# Altium project FPGABoard.PrjPcb
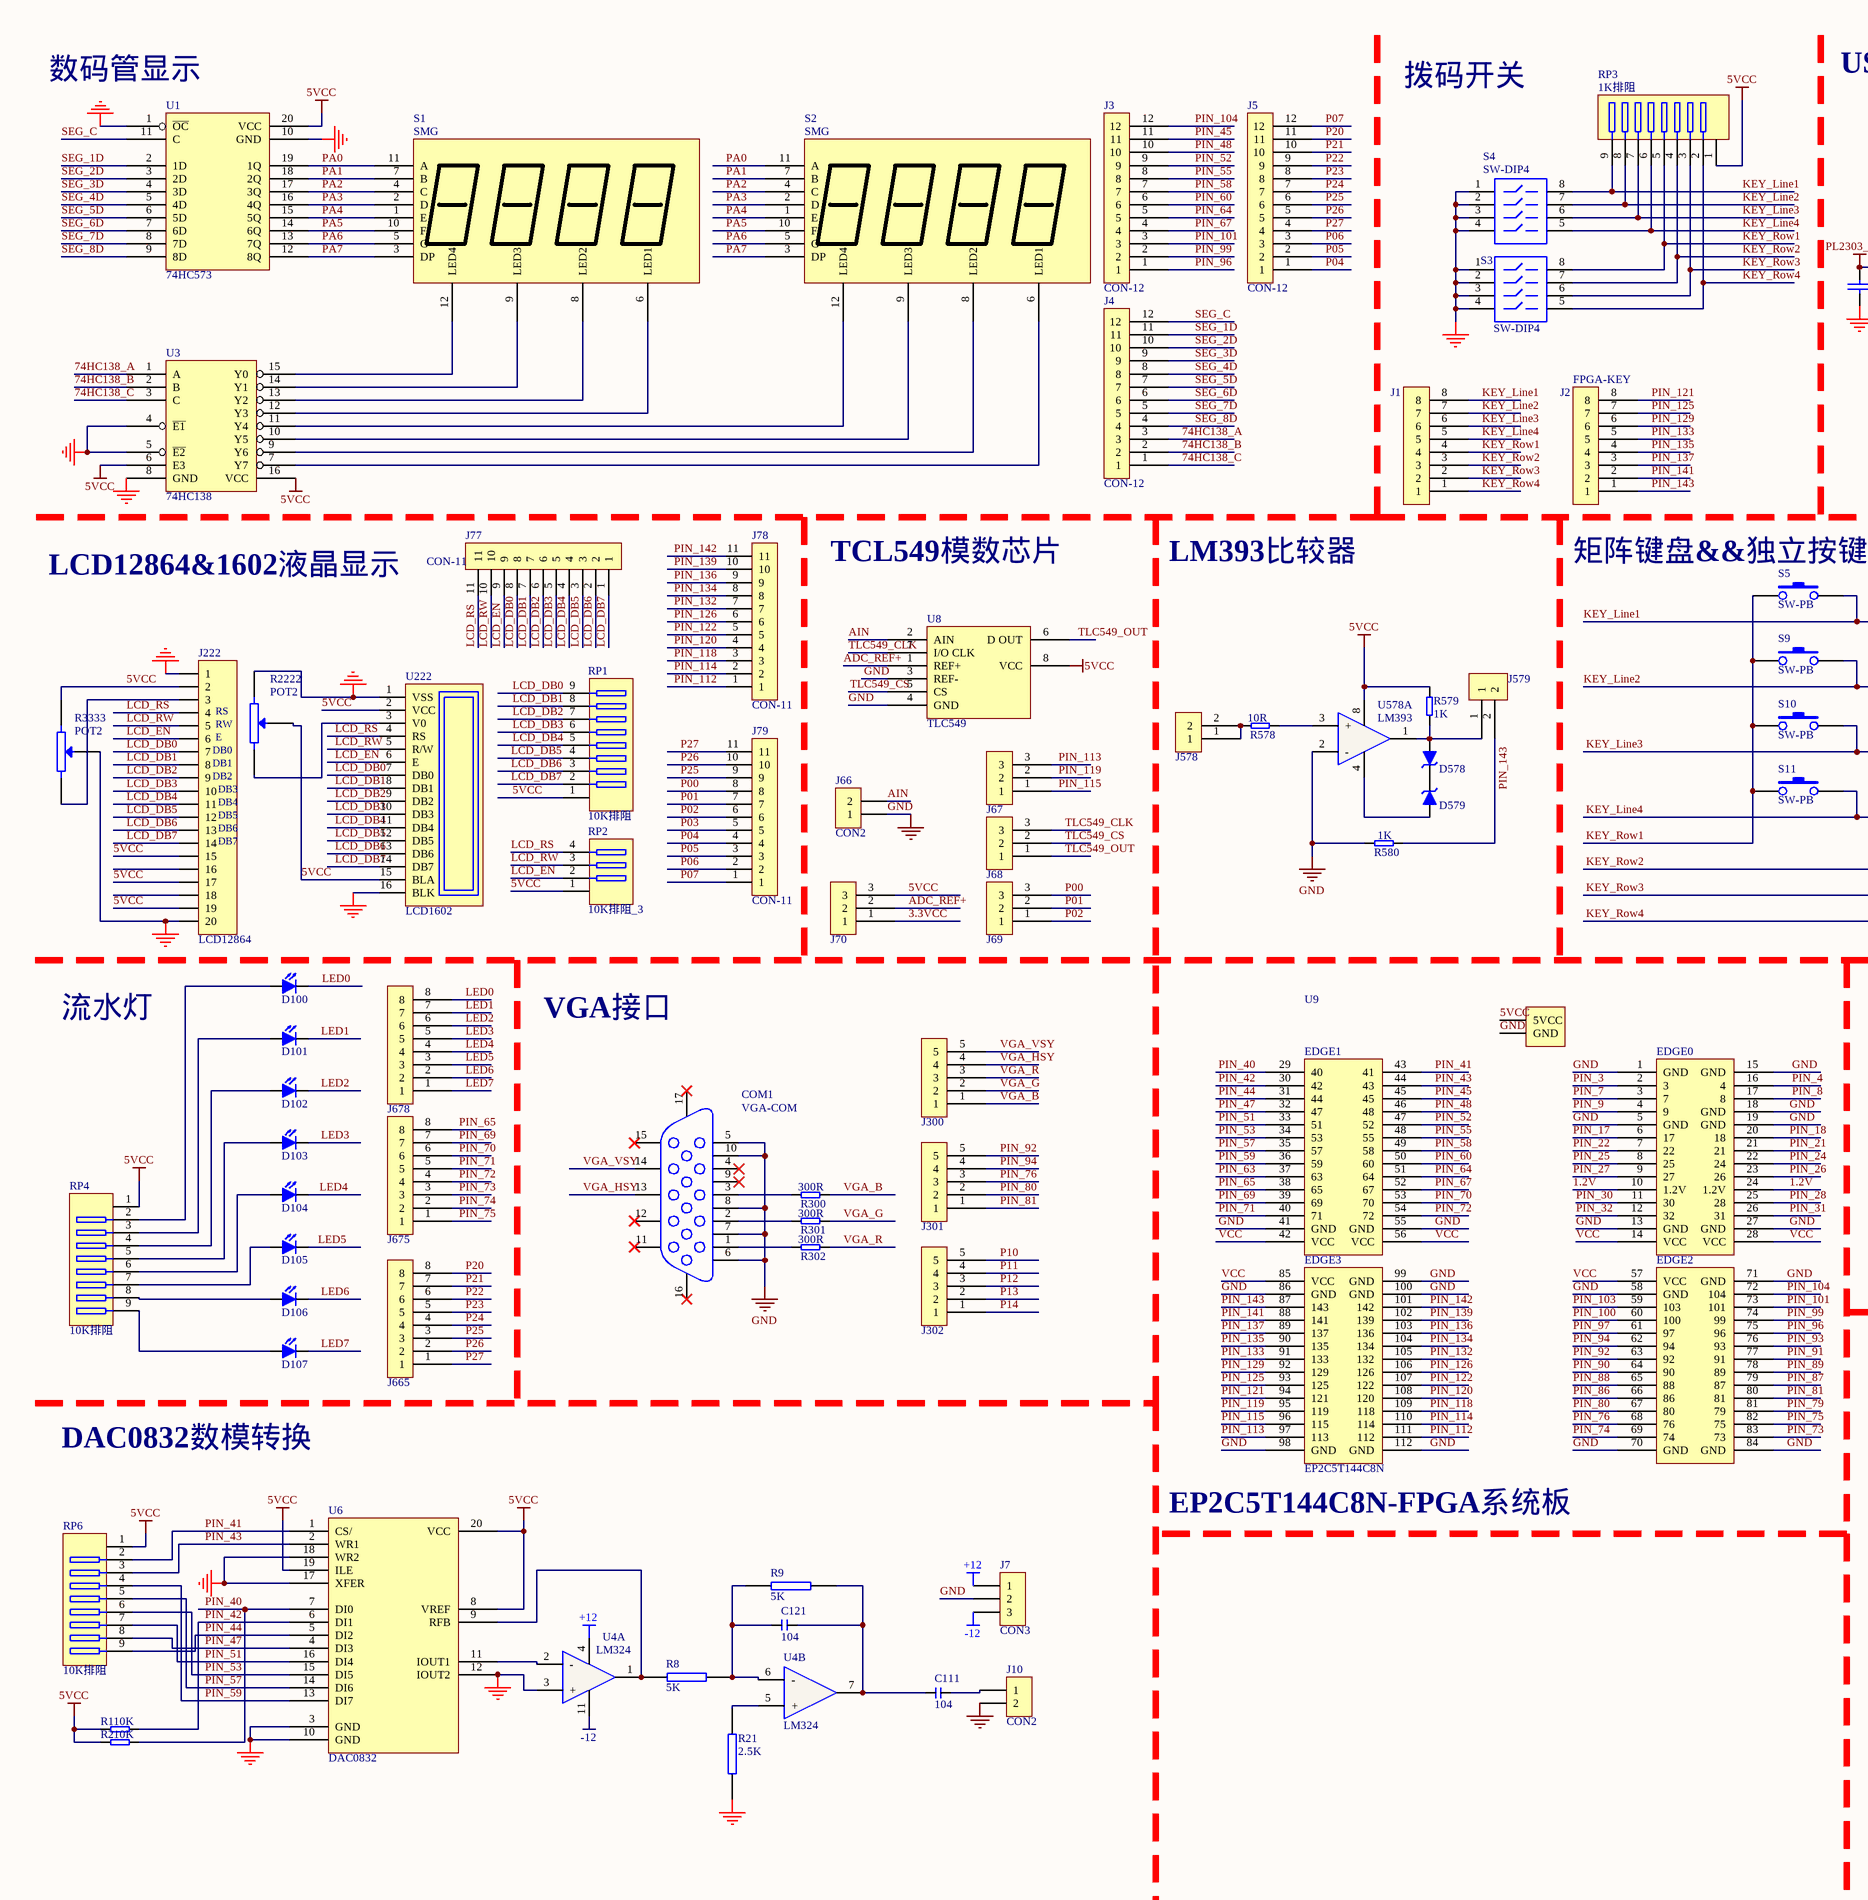
[diagram p0: FPGABoard.SchDoc, left]
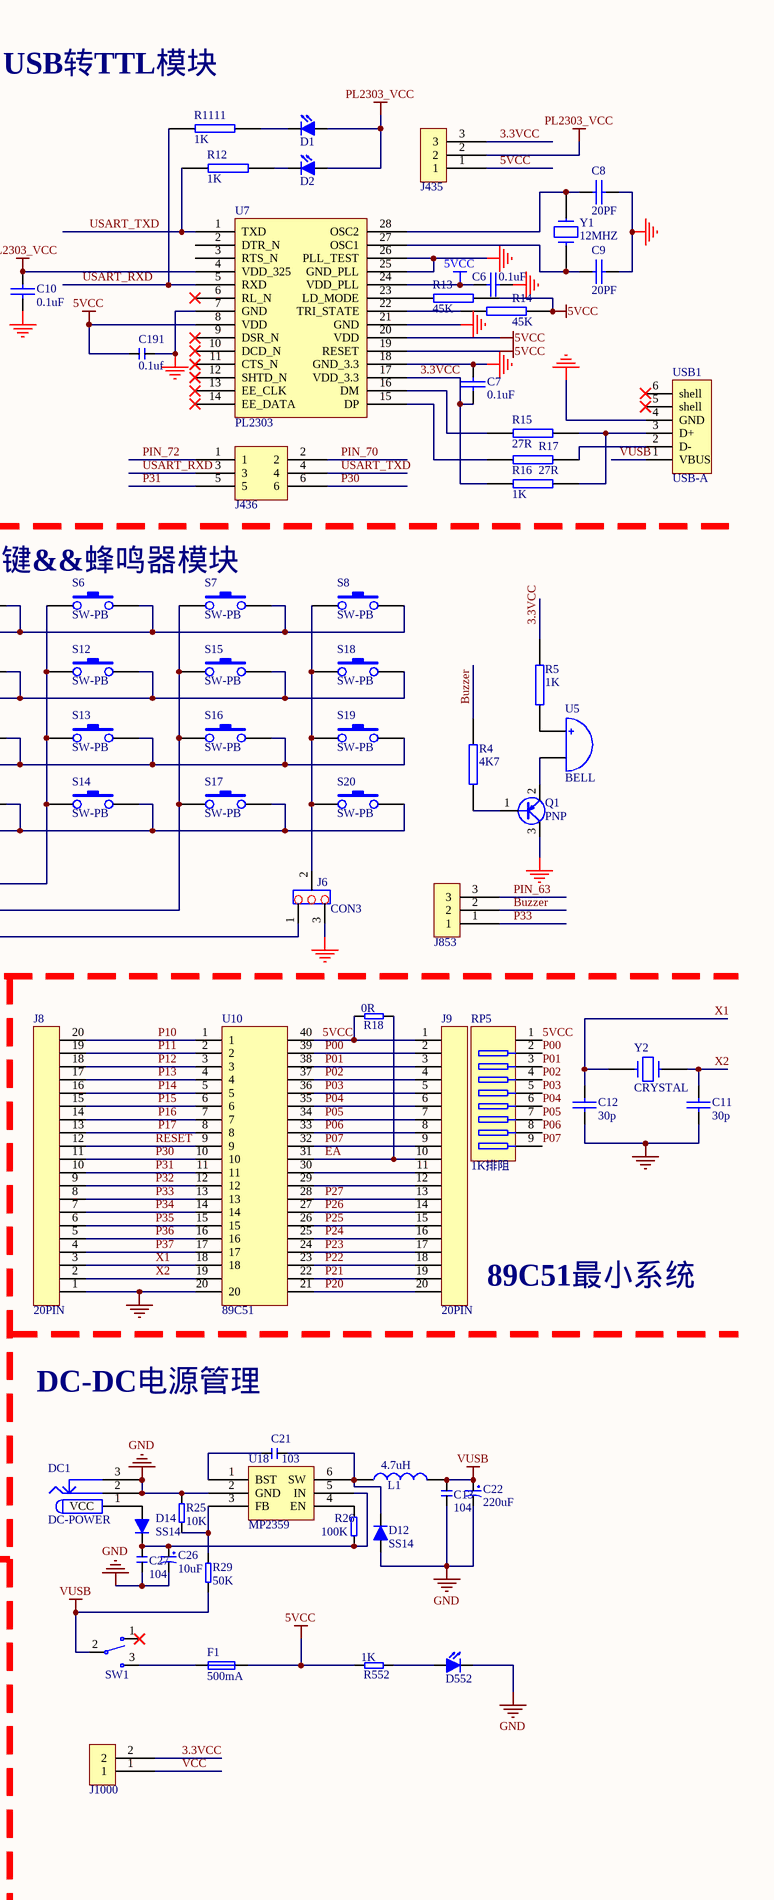
[diagram p1: FPGABoard.SchDoc, right]
1 sheet, 135 parts. Net scope: global (net labels, ports and power ports of the same name join across sheets).
Board file: FPGABoard.PcbDoc

## Sheet FPGABoard.SchDoc
size C; SheetNumber: 0; SheetTotal: 0

### Parts
C6  0.1uF  [C0805]
C7  0.1uF  [C0805]
C8  20PF  [C0805]
C9  20PF  [C0805]
C10  0.1uF  [C0805]
C11  30p  [0805]
C12  30p  [0805]
C13  104  [C0805]
C21  103  [C0805]
C22  220uF  [CA-6.3mmx6.3mm]
C26  10uF  [CA-A-3216L]
C27  104  [C0805]
C111  104  [C0805]
C121  104  [C0805]
C191  0.1uf  [C0805]
COM1  VGA-COM  [VGA-15]
D1  LED  [LED0805-RED]  (value not drawn)
D2  LED  [LED0805-RED]  (value not drawn)
D12  SS14  [DO-214]
D14  SS14  [DO-214]
D100  LED  [LED0805-RED]  (value not drawn)
D101  LED  [LED0805-RED]  (value not drawn)
D102  LED  [LED0805-RED]  (value not drawn)
D103  LED  [LED0805-RED]  (value not drawn)
D104  LED  [LED0805-RED]  (value not drawn)
D105  LED  [LED0805-RED]  (value not drawn)
D106  LED  [LED0805-RED]  (value not drawn)
D107  LED  [LED0805-RED]  (value not drawn)
D552  LED  [LED0805-GREEN]  (value not drawn)
D578  DIODE-ZENER3  [D1206]  (value not drawn)
D579  DIODE-ZENER3  [D1206]  (value not drawn)
DC1  DC-POWER  [DC-5v]
F1  500mA  [0805]
J1  CON-8  [SIP8-2.54]  (value not drawn)
J2  FPGA-KEY  [SIP8-2.54]
J3  CON-12  [SIP12-2.54]
J4  CON-12  [SIP12-2.54]
J5  CON-12  [SIP12-2.54]
J6  CON3  [SIP3-2.54]
J7  CON3  [SIP3-2.54]
J8  20PIN  [SIP20-2.54]
J9  20PIN  [SIP20-2.54]
J10  CON2  [SIP2-2.54]
J66  CON2  [SIP2-2.54]
J67  CON-3  [SIP3-2.54]  (value not drawn)
J68  CON-3  [SIP3-2.54]  (value not drawn)
J69  CON-3  [SIP3-2.54]  (value not drawn)
J70  CON-3  [SIP3-2.54]  (value not drawn)
J77  CON-11  [SIP11-2.54]
J78  CON-11  [SIP11-2.54]
J79  CON-11  [SIP11-2.54]
J222  LCD12864  [SIP20-2.54]
J300  CON-5  [SIP5-2.54]  (value not drawn)
J301  CON-5  [SIP5-2.54]  (value not drawn)
J302  CON-5  [SIP5-2.54]  (value not drawn)
J435  CON-3  [SIP3-2.54]  (value not drawn)
J436  CON-2*3  [J2X3-2.54mm]  (value not drawn)
J578  CON-2  [J1x2-2.54mm]  (value not drawn)
J579  CON-2  [J1x2-2.54mm]  (value not drawn)
J665  CON-8  [SIP8-2.54]  (value not drawn)
J675  CON-8  [SIP8-2.54]  (value not drawn)
J678  CON-8  [SIP8-2.54]  (value not drawn)
J853  CON-3  [SIP3-2.54]  (value not drawn)
J1000  CON-2  [J1x2-2.54mm]  (value not drawn)
L1  4.7uH  [L-SOP74]
Q1  PNP  [SOT-23A]
R1  10K  [R-0805]
R2  10K  [R-0805]
R4  4K7  [R0805]
R5  1K  [R0805]
R8  5K  [R0805]
R9  5K  [R0805]
R12  1K  [0805]
R13  45K  [0805]
R14  45K  [0805]
R15  27R  [0805]
R16  1K  [0805]
R17  27R  [0805]
R18  0R  [R0805]
R21  2.5K  [R0805]
R25  10K  [R-0805]
R26  100K  [R-0805]
R29  50K  [R-0805]
R300  300R  [R-0805]
R301  300R  [R-0805]
R302  300R  [R-0805]
R552  1K  [0805]
R578  10R  [R-0805]
R579  1K  [R-0805]
R580  1K  [R-0805]
R1111  1K  [0805]
R2222  POT2  [VR5]
R3333  POT2  [VR5]
RP1  10K排阻  [SIP9-2.54]
RP2  10K排阻_3  [SIP4-2.54]
RP3  1K排阻  [SIP9-2.54]
RP4  10K排阻  [SIP9-2.54]
RP5  1K排阻  [SIP9-2.54]
RP6  10K排阻  [SIP9-2.54]
S1  SMG  [LED4_0.28_DIP12]
S2  SMG  [LED4_0.28_DIP12]
S3  SW-DIP4  [DIP-KEY-4]
S4  SW-DIP4  [DIP-KEY-4]
S5  SW-PB  [KEY]
S6  SW-PB  [KEY]
S7  SW-PB  [KEY]
S8  SW-PB  [KEY]
S9  SW-PB  [KEY]
S10  SW-PB  [KEY]
S11  SW-PB  [KEY]
S12  SW-PB  [KEY]
S13  SW-PB  [KEY]
S14  SW-PB  [KEY]
S15  SW-PB  [KEY]
S16  SW-PB  [KEY]
S17  SW-PB  [KEY]
S18  SW-PB  [KEY]
S19  SW-PB  [KEY]
S20  SW-PB  [KEY]
SW1  SW-SPDP  [SW-DPDT]  (value not drawn)
U1  74HC573  [SO-20W]
U3  74HC138  [SOP-16-NB]
U4  LM324  [SOP14-225-50]  (parts A,B of 4)
U5  BELL  [BELL]
U6  DAC0832  [DIP-20N]
U7  PL2303  [SSOP-SS28_N]
U8  TLC549  [SOP-8-NB]
U9  EP2C5T144C8N  [HXB]
U10  89C51  [ZIP_40]
U18  MP2359  [SOT23-6]
U222  LCD1602  [SIP16-2.54]
U578  LM393  [SOP-8-NB]  (part A of 2)
USB1  USB-A  [USB-HD-1X1-1]
Y1  12MHZ  [XTAL]
Y2  CRYSTAL  [XTAL2]

### Nets
5VCC: C6.1 C191.1 F1.2 J9.1 J70.3 J222.2 J222.15 J222.17 J222.19 J435.1 R1.1 R2.1 R13.1 R14.1 R18.1 R552.1 R579.2 R2222.3 R3333.1 RP1.1 RP2.1 RP3.1 RP4.1 RP5.1 RP6.1 U1.20(VCC) U3.6(E3) U3.16(VCC) U6.8(VREF) U6.19(ILE) U6.20(VCC) U7.8(VDD) U7.19(RESET) U7.20(VDD) U7.24(VDD_PLL) U8.8(VCC) U9.5VCC U10.40 U222.2(VCC) U222.15(BLA) U578.8
+12: J7.1 U4.4
-12: J7.3 U4.11
GND: C6.2 C7.1 C8.2 C9.2 C10.2 C11.2 C12.2 C13.2 C22.2 C26.2 C27.2 C191.2 COM1.5 COM1.6 COM1.7 COM1.8 COM1.10 D12.1 D552.2 DC1.2(GND) DC1.3(GND) J6.3 J7.2 J8.1 J10.2 J66.1 J222.1 J222.20 Q1.3(Collector) R21.1 R25.1 R580.1 R2222.1 R3333.3 S3.1 S3.2 S3.3 S3.4 S4.1 S4.2 S4.3 S4.4 U1.1(~{OC}) U1.10(GND) U3.4(~{E1}) U3.5(~{E2}) U3.8(GND) U4.3(+) U6.3(GND) U6.10(GND) U6.12(IOUT2) U6.17(XFER) U6.18(WR2) U7.7(GND) U7.18(GND_3.3) U7.21(GND) U7.25(GND_PLL) U7.26(PLL_TEST) U8.3(REF-) U8.4(GND) U9.1(GND) U9.5(GND) U9.13(GND) U9.15(GND) U9.18(GND) U9.19(GND) U9.27(GND) U9.41(GND) U9.55(GND) U9.58(GND) U9.70(GND) U9.71(GND) U9.84(GND) U9.86(GND) U9.98(GND) U9.99(GND) U9.100(GND) U9.112(GND) U9.GND U10.20 U18.2(GND) U222.1(VSS) U222.16(BLK) U578.2(-) USB1.4(GND)
PL2303_VCC: C10.1 D1.1 D2.1 J435.2 U7.4(VDD_325)
VUSB: C13.1 C22.1 L1.2 R29.2 SW1.2 USB1.1(VBUS)
1.2V: U9.10(1.2V) U9.24(1.2V)
3.3VCC: C7.2 J70.1 J435.3 J1000.2 R5.2 R16.2 U7.17(VDD_3.3)
74HC138_A: J4.3 U3.1(A)
74HC138_B: J4.2 U3.2(B)
74HC138_C: J4.1 U3.3(C)
ADC_REF+: J70.2 U8.1(REF+)
AIN: J66.2 U8.2(AIN)
Buzzer: J853.2 R4.1
EA: J9.10 R18.2 U10.31
KEY_Line1: J1.8 RP3.9 S4.8 S5.3 S6.3 S7.3 S8.3
KEY_Line2: J1.7 RP3.8 S4.7 S9.3 S12.3 S15.3 S18.3
KEY_Line3: J1.6 RP3.7 S4.6 S10.3 S13.3 S16.3 S19.3
KEY_Line4: J1.5 RP3.6 S4.5 S11.3 S14.3 S17.3 S20.3
KEY_Row1: J1.4 RP3.5 S3.8 S5.1 S9.1 S10.1 S11.1
KEY_Row2: J1.3 RP3.4 S3.7 S6.1 S12.1 S13.1 S14.1
KEY_Row3: J1.2 RP3.3 S3.6 S7.1 S15.1 S16.1 S17.1
KEY_Row4: J1.1 J6.1 RP3.2 S3.5
LCD_DB0: J77.8 J222.7 RP1.9 U222.7(DB0)
LCD_DB1: J77.7 J222.8 RP1.8 U222.8(DB1)
LCD_DB2: J77.6 J222.9 RP1.7 U222.9(DB2)
LCD_DB3: J77.5 J222.10 RP1.6 U222.10(DB3)
LCD_DB4: J77.4 J222.11 RP1.5 U222.11(DB4)
LCD_DB5: J77.3 J222.12 RP1.4 U222.12(DB5)
LCD_DB6: J77.2 J222.13 RP1.3 U222.13(DB6)
LCD_DB7: J77.1 J222.14 RP1.2 U222.14(DB7)
LCD_EN: J77.9 J222.6 RP2.2 U222.6(E)
LCD_RS: J77.11 J222.4 RP2.4 U222.4(RS)
LCD_RW: J77.10 J222.5 RP2.3 U222.5(R/W)
LED0: D100.2 J678.8
LED1: D101.2 J678.7
LED2: D102.2 J678.6
LED3: D103.2 J678.5
LED4: D104.2 J678.4
LED5: D105.2 J678.3
LED6: D106.2 J678.2
LED7: D107.2 J678.1
P00: J9.2 J69.3 J79.8 RP5.2 U10.39
P01: J9.3 J69.2 J79.7 RP5.3 U10.38
P02: J9.4 J69.1 J79.6 RP5.4 U10.37
P03: J9.5 J79.5 RP5.5 U10.36
P04: J5.1 J9.6 J79.4 RP5.6 U10.35
P05: J5.2 J9.7 J79.3 RP5.7 U10.34
P06: J5.3 J9.8 J79.2 RP5.8 U10.33
P07: J5.12 J9.9 J79.1 RP5.9 U10.32
P10: J8.20 J302.5 U10.1
P11: J8.19 J302.4 U10.2
P12: J8.18 J302.3 U10.3
P13: J8.17 J302.2 U10.4
P14: J8.16 J302.1 U10.5
P15: J8.15 U10.6
P16: J8.14 U10.7
P17: J8.13 U10.8
P20: J5.11 J9.20 J665.8 U10.21
P21: J5.10 J9.19 J665.7 U10.22
P22: J5.9 J9.18 J665.6 U10.23
P23: J5.8 J9.17 J665.5 U10.24
P24: J5.7 J9.16 J665.4 U10.25
P25: J5.6 J9.15 J79.9 J665.3 U10.26
P26: J5.5 J9.14 J79.10 J665.2 U10.27
P27: J5.4 J9.13 J79.11 J665.1 U10.28
P30: J8.11 J436.6 U10.10
P31: J8.10 J436.5 U10.11
P32: J8.9 U10.12
P33: J8.8 J853.1 U10.13
P34: J8.7 U10.14
P35: J8.6 U10.15
P36: J8.5 U10.16
P37: J8.4 U10.17
PA0: S1.11(A) S2.11(A) U1.19(1Q)
PA1: S1.7(B) S2.7(B) U1.18(2Q)
PA2: S1.4(C) S2.4(C) U1.17(3Q)
PA3: S1.2(D) S2.2(D) U1.16(4Q)
PA4: S1.1(E) S2.1(E) U1.15(5Q)
PA5: S1.10(F) S2.10(F) U1.14(6Q)
PA6: S1.5(G) S2.5(G) U1.13(7Q)
PA7: S1.3(DP) S2.3(DP) U1.12(8Q)
PIN_3: U9.2(3)
PIN_4: U9.16(4)
PIN_7: U9.3(7)
PIN_8: U9.17(8)
PIN_9: U9.4(9)
PIN_17: U9.6(17)
PIN_18: U9.20(18)
PIN_21: U9.21
PIN_22: U9.7(22)
PIN_24: U9.22(24)
PIN_25: U9.8(25)
PIN_26: U9.23(26)
PIN_27: U9.9(27)
PIN_28: U9.25(28)
PIN_30: U9.11(30)
PIN_31: U9.26(31)
PIN_32: U9.12(32)
PIN_40: R2.2 U6.7(DI0) U9.29(40)
PIN_41: RP6.2 U6.1(CS/) U9.43(41)
PIN_42: R1.2 U6.6(DI1) U9.30(42)
PIN_43: RP6.3 U6.2(WR1) U9.44(43)
PIN_44: RP6.9 U6.5(DI2) U9.31(44)
PIN_45: J3.11 U9.45
PIN_47: RP6.8 U6.4(DI3) U9.32(47)
PIN_48: J3.10 U9.46(48)
PIN_51: RP6.7 U6.16(DI4) U9.33(51)
PIN_52: J3.9 U9.47(52)
PIN_53: RP6.6 U6.15(DI5) U9.34(53)
PIN_55: J3.8 U9.48(55)
PIN_57: RP6.5 U6.14(DI6) U9.35(57)
PIN_58: J3.7 U9.49(58)
PIN_59: RP6.4 U6.13(DI7) U9.36(59)
PIN_60: J3.6 U9.50(60)
PIN_63: J853.3 U9.37(63)
PIN_64: J3.5 U9.51(64)
PIN_65: J675.8 U9.38(65)
PIN_67: J3.4 U9.52(67)
PIN_69: J675.7 U9.39(69)
PIN_70: J436.2 J675.6 U9.53(70)
PIN_71: J675.5 U9.40(71)
PIN_72: J436.1 J675.4 U9.54(72)
PIN_73: J675.3 U9.83(73)
PIN_74: J675.2 U9.69(74)
PIN_75: J675.1 U9.82(75)
PIN_76: J301.3 U9.68(76)
PIN_79: U9.81(79)
PIN_80: J301.2 U9.67(80)
PIN_81: J301.1 U9.80(81)
PIN_86: U9.66(86)
PIN_87: U9.79(87)
PIN_88: U9.65(88)
PIN_89: U9.78(89)
PIN_90: U9.64(90)
PIN_91: U9.77(91)
PIN_92: J301.5 U9.63(92)
PIN_93: U9.76(93)
PIN_94: J301.4 U9.62(94)
PIN_96: J3.1 U9.75(96)
PIN_97: U9.61(97)
PIN_99: J3.2 U9.74(99)
PIN_100: U9.60(100)
PIN_101: J3.3 U9.73(101)
PIN_103: U9.59(103)
PIN_104: J3.12 U9.72(104)
PIN_112: J78.1 U9.111(112)
PIN_113: J67.3 U9.97(113)
PIN_114: J78.2 U9.110(114)
PIN_115: J67.1 U9.96(115)
PIN_118: J78.3 U9.109(118)
PIN_119: J67.2 U9.95(119)
PIN_120: J78.4 U9.108(120)
PIN_121: J2.8 U9.94(121)
PIN_122: J78.5 U9.107(122)
PIN_125: J2.7 U9.93(125)
PIN_126: J78.6 U9.106(126)
PIN_129: J2.6 U9.92(129)
PIN_132: J78.7 U9.105(132)
PIN_133: J2.5 U9.91(133)
PIN_134: J78.8 U9.104(134)
PIN_135: J2.4 U9.90(135)
PIN_136: J78.9 U9.103(136)
PIN_137: J2.3 U9.89(137)
PIN_139: J78.10 U9.102(139)
PIN_141: J2.2 U9.88(141)
PIN_142: J78.11 U9.101(142)
PIN_143: J2.1 J579.2 R580.2 U9.87(143)
RESET: J8.12 U10.9
SEG_1D: J4.11 U1.2(1D)
SEG_2D: J4.10 U1.3(2D)
SEG_3D: J4.9 U1.4(3D)
SEG_4D: J4.8 U1.5(4D)
SEG_5D: J4.7 U1.6(5D)
SEG_6D: J4.6 U1.7(6D)
SEG_7D: J4.5 U1.8(7D)
SEG_8D: J4.4 U1.9(8D)
SEG_C: J4.12 U1.11(C)
TLC549_CLK: J68.3 U8.7(I/O_CLK)
TLC549_CS: J68.2 U8.5(CS)
TLC549_OUT: J68.1 U8.6(D_OUT)
USART_RXD: J436.3 R1111.2 U7.5(RXD)
USART_TXD: J436.4 R12.2 U7.1(TXD)
VCC: J1000.1 U9.14(VCC) U9.28(VCC) U9.42(VCC) U9.56(VCC) U9.57(VCC) U9.85(VCC)
VGA_B: J300.1 R300.2
VGA_G: J300.2 R301.2
VGA_HSY: COM1.13 J300.4
VGA_R: J300.3 R302.2
VGA_VSY: COM1.14 J300.5
X1: C12.1 J8.3 U10.18 Y2.1
X2: C11.1 J8.2 U10.19 Y2.2
NetC8_1: C8.1 U7.28(OSC2) Y1.1
NetC9_1: C9.1 U7.27(OSC1) Y1.2
NetC21_1: C21.1 U18.1(BST)
NetC21_2: C21.2 D12.2 L1.1 U18.6(SW)
NetC26_1: C26.1 C27.1 D14.2 R26.1 U18.5(IN)
NetC111_1: C111.1 C121.2 R9.1 U4.7
NetC111_2: C111.2 J10.1
NetC121_1: C121.1 R8.1 R9.2 U4.6(-)
NetCOM1_1: COM1.1 R302.1
NetCOM1_2: COM1.2 R301.1
NetCOM1_3: COM1.3 R300.1
NetD1_2: D1.2 R1111.1
NetD2_2: D2.2 R12.1
NetD14_1: D14.1 DC1.1(VCC)
NetD100_1: D100.1 RP4.2
NetD101_1: D101.1 RP4.3
NetD102_1: D102.1 RP4.4
NetD103_1: D103.1 RP4.5
NetD104_1: D104.1 RP4.6
NetD105_1: D105.1 RP4.7
NetD106_1: D106.1 RP4.8
NetD107_1: D107.1 RP4.9
NetD552_1: D552.1 R552.2
NetD578_1: D578.1 J579.1 R579.1 U578.1
NetD578_2: D578.2 D579.2
NetD579_1: D579.1 U578.4
NetF1_1: F1.1 SW1.3
NetJ6_2: J6.2 S8.1 S18.1 S19.1 S20.1
NetJ9_11: J9.11 U10.30
NetJ9_12: J9.12 U10.29
NetJ222_3: J222.3 R3333.2
NetJ578_1: J578.1 J578.2 R578.1
NetQ1_1: Q1.1(Base) R4.2
NetQ1_2: Q1.2(Emitter) U5.2
NetR5_1: R5.1 U5.1
NetR8_2: R8.2 U4.1 U6.9(RFB)
NetR13_2: R13.2 U7.23(LD_MODE)
NetR14_2: R14.2 U7.22(TRI_STATE)
NetR15_1: R15.1 R16.1 USB1.3(D+)
NetR15_2: R15.2 U7.16(DM)
NetR17_1: R17.1 USB1.2(D-)
NetR17_2: R17.2 U7.15(DP)
NetR21_2: R21.2 U4.5(+)
NetR25_2: R25.2 R29.1 U18.3(FB)
NetR26_2: R26.2 U18.4(EN)
NetR578_2: R578.2 U578.3(+)
NetR2222_2: R2222.2 U222.3(V0)
NetS1_6: S1.6(LED1) U3.12(Y3)
NetS1_8: S1.8(LED2) U3.13(Y2)
NetS1_9: S1.9(LED3) U3.14(Y1)
NetS1_12: S1.12(LED4) U3.15(Y0)
NetS2_6: S2.6(LED1) U3.7(Y7)
NetS2_8: S2.8(LED2) U3.9(Y6)
NetS2_9: S2.9(LED3) U3.10(Y5)
NetS2_12: S2.12(LED4) U3.11(Y4)
NetU4_2: U4.2(-) U6.11(IOUT1)

Not connected (* = marked no-connect by the designer): COM1 4* 9* 11* 12* 15* 16* 17*; J222 16 18; SW1 1*; U7 2(DTR_N) 3(RTS_N) 6(RL_N)* 9(DSR_N)* 10(DCD_N)* 11(CTS_N)* 12(SHTD_N)* 13(EE_CLK)* 14(EE_DATA)*; USB1 5(shell)* 6(shell)*

### Notes on the sheet
- 数码管显示
- USB转TTL模块
- 拨码开关
- LCD12864&1602液晶显示
- TCL549模数芯片
- LM393比较器
- (near S5) 矩阵键盘&&独立按键&&蜂鸣器模块
- RS
- RW
- (near J222) E
- (near J222) DB0
- (near J222) DB1
- (near J222) DB2
- (near J222) DB3
- (near J222) DB4
- (near J222) DB5
- (near J222) DB6
- (near J222) DB7
- 流水灯
- VGA接口
- (near J9) 89C51最小系统
- DC-DC电源管理
- DAC0832数模转换
- (near U9) EP2C5T144C8N-FPGA系统板
- (in symbol EP2C5T144C8N) EDGE1; EDGE0; EDGE3; EDGE2

### Library data of the parts
C6-C12 = CAP: Capacitor
C13 C21 C27 C111 C121 C191 = CAP
C22 C26 = CAP-ELEC
D12 D14 = DIODE
DC1 = DC
F1 = FUSE
J2 = CON-8
J7 = CON3: Connector
J10 J66 = CON2: Connector
J222 = LCD12864: 20PIN
L1 = INDUCTOR
Q1 = AUDION-PNP
R1 R2 R18 R25 R26 R29 R300-R302 R552 R578-R580 = RES
R4 R5 R8 R9 R12-R17 R21 R1111 = RES2
R2222 R3333 = POT2: Potentiometer
RP1 RP3-RP6 = 10K排阻: 330
RP2 = 10K排阻_3: 330
U222 = LCD1602: 16PIN
Y1 = CRYSTAL